# EAGLE schematic tetrisClock (EAGLE 5.10)
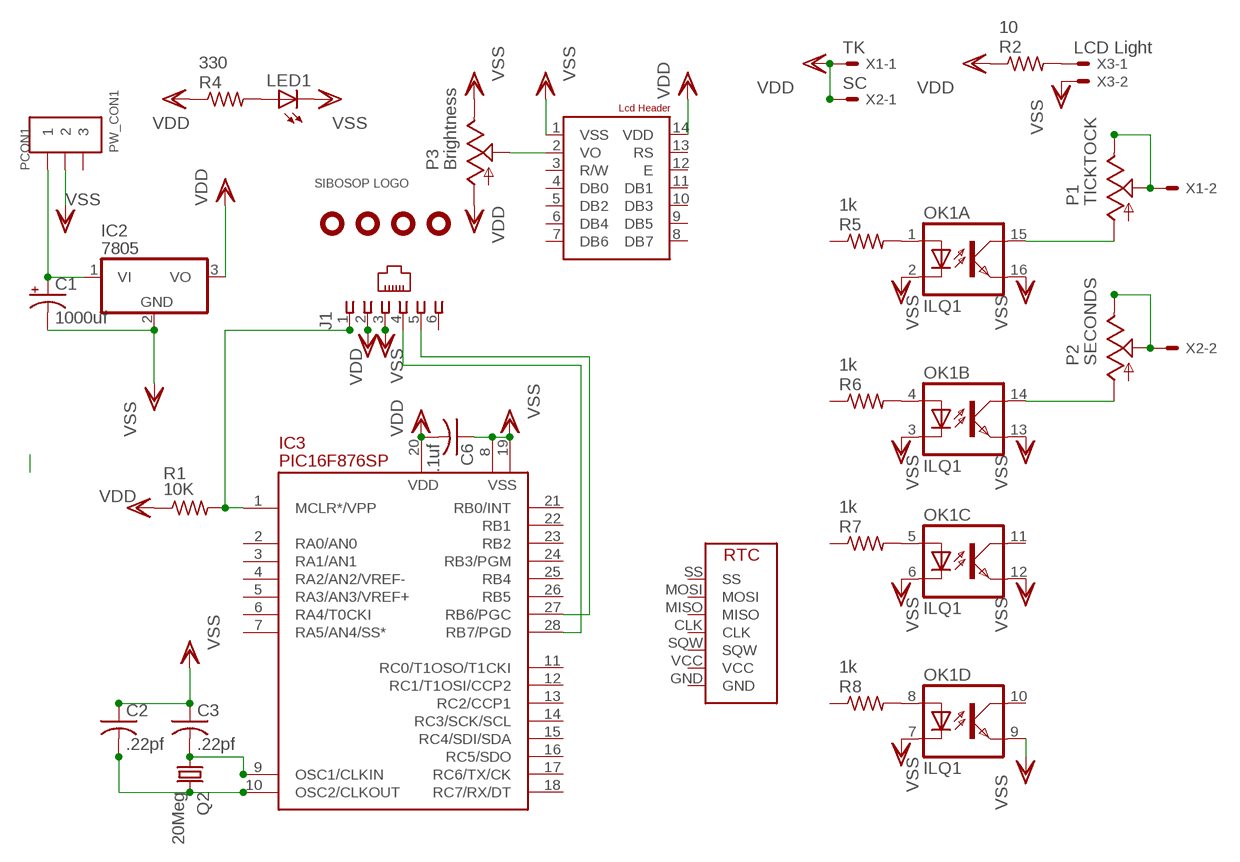
[diagram p0: schematic, sheet 1]

## Parts
C1  1000uf  CPOL-USE3.5-10  [E3,5-10]
C2  .22pf  C-US025-024X044  [C025-024X044]
C3  .22pf  C-US025-024X044  [C025-024X044]
C6  .1uf  C-US025-024X044  [C025-024X044]
H1  LCDHEADER  [DIL14]
IC2  7805  [TO220V]
IC3  PIC16F876SP  [DIL28-3]
J1  520250-3  [520250-3]
LED1  LEDSQR2X5  [LED2X5]
OK1  ILQ1  [DIL16]
P1  TICKTOCK  TRIMPOT  [RJ6S]
P2  SECONDS  TRIMPOT  [RJ6S]
P3  Brightness  TRIMPOT  [RJ6S]
PCON1  PW_CON1  [PW_CON1]
Q2  20Meg  CRYSTALHC49S  [HC49/S]
R1  10K  R-US_0204/2V  [0204V]
R2  10  R-US_0204/2V  [0204V]
R4  330  R-US_0204/2V  [0204V]
R5  1k  R-US_0204/2V  [0204V]
R6  1k  R-US_0204/2V  [0204V]
R7  1k  R-US_0204/2V  [0204V]
R8  1k  R-US_0204/2V  [0204V]
U1  SPARKRTC  [SPARKRTC]
U$1  HOLE-125  [HOLE-125]
U$2  HOLE-125  [HOLE-125]
U$3  LOGO  [LOGO]
U$5  HOLE-125  [HOLE-125]
U$6  HOLE-125  [HOLE-125]
X1  TK  22-23-2021  [22-23-2021]
X2  SC  22-23-2021  [22-23-2021]
X3  LCD Light  22-23-2021  [22-23-2021]

## Nets
N$1: IC3.1(MCLR*/VPP) J1.1 R1.2
N$2: C1.+ IC2.1(VI) PCON1.P$1
N$3: C2.2 IC3.10(OSC2/CLKOUT) Q2.2
N$4: C3.2 IC3.9(OSC1/CLKIN) Q2.1
N$5: P1.E P1.S X1.2
N$7: H1.2(VO) P3.S
N$8: P2.E P2.S X2.2
N$9: R2.2 X3.1
N$11: OK1.15(A:COL) P1.A
N$14: IC3.27(RB6/PGC) J1.5
N$15: OK1.14(B:COL) P2.A
N$18: IC3.28(RB7/PGD) J1.4
N$19: OK1.1(A:A) R5.2
N$20: OK1.4(B:A) R6.2
N$21: OK1.5(C:A) R7.2
N$22: LED1.A R4.2
N$23: OK1.8(D:A) R8.2
VDD: C6.2 H1.14(VDD) IC2.3(VO) IC3.20(VDD) J1.2 P3.A R1.1 R2.1 R4.1 X1.1 X2.1
VSS: C1.- C2.1 C3.1 C6.1 H1.1(VSS) IC2.2(GND) IC3.8(VSS) IC3.19(VSS) J1.3 LED1.K(C) OK1.2(A:C) OK1.3(B:C) OK1.6(C:C) OK1.7(D:C) OK1.9(D:EMIT) OK1.12(C:EMIT) OK1.13(B:EMIT) OK1.16(A:EMIT) P3.E PCON1.P$2 X3.2
Unconnected: H1.3(R/W) H1.4(DB0) H1.5(DB2) H1.6(DB4) H1.7(DB6) H1.8(DB7) H1.9(DB5) H1.10(DB3) H1.11(DB1) H1.12(E) H1.13(RS) IC3.2(RA0/AN0) IC3.3(RA1/AN1) IC3.4(RA2/AN2/VREF-) IC3.5(RA3/AN3/VREF+) IC3.6(RA4/T0CKI) IC3.7(RA5/AN4/SS*) IC3.11(RC0/T1OSO/T1CKI) IC3.12(RC1/T1OSI/CCP2) IC3.13(RC2/CCP1) IC3.14(RC3/SCK/SCL) IC3.15(RC4/SDI/SDA) IC3.16(RC5/SDO) IC3.17(RC6/TX/CK) IC3.18(RC7/RX/DT) IC3.21(RB0/INT) IC3.22(RB1) IC3.23(RB2) IC3.24(RB3/PGM) IC3.25(RB4) IC3.26(RB5) J1.6 OK1.10(D:COL) OK1.11(C:COL) PCON1.P$3 R5.1 R6.1 R7.1 R8.1 U1.CLK U1.MISO U1.MOSI U1.SQW U1.SS

## Power pins joined to a net without a drawn wire
GND: U1.GND
VCC: U1.VCC

## Library data of the parts
C1 = rcl:CPOL-US: POLARIZED CAPACITOR, American symbol
C2 C3 C6 = rcl:C-US: CAPACITOR, American symbol
H1 = sibosop:LCDHEADER: 14 pin lcd header
IC2 = kmarx1:78*: 78xx Family - Positive voltage regulator
IC3 = pic16f87x:PIC16F876: FLASH MICROCONTROLLER
J1 = con-amp:520250-3: AMP connector
LED1 = led:LED: LED OSRAM: - CHIPLED LG R971, LG N971, LY N971, LG Q971, LY Q971, LO R971, LY R971 LH N974, LH R974 LS Q976, LO Q976, LY Q976 LO Q996 - Hyper CHIPLED LW Q18S LB Q993, LB Q99A, LB R99A - SideLED LS A670, LO A670, LY A670, LG A670, LP A670 LB A673, LV A673, LT A673, LW A673 LH A674 LY A675 LS A676, LA A676, LO A676, LY A676, LW A676 LS A679, LY A679, LG A679 - Hyper Micro SIDELED® LS Y876, LA Y876, LO Y876, LY Y876 LT Y87S - SmartLED LW L88C, LW L88S LB L89C, LB L89S, LG L890 LS L89K, LO L89K, LY L89K LS L896, LA L896, LO L896, LY L896 - TOPLED LS T670, LO T670, LY T670, LG T670, LP T670 LSG T670, LSP T670, LSY T670, LOP T670, LYG T670 LG T671, LOG T671, LSG T671 LB T673, LV T673, LT T673, LW T673 LH T674 LS T676, LA T676, LO T676, LY T676, LB T676, LH T676, LSB T676, LW T676 LB T67C, LV T67C, LT T67C, LS T67K, LO T67K, LY T67K, LW E67C LS E67B, LA E67B, LO E67B, LY E67B, LB E67C, LV E67C, LT E67C LW T67C LS T679, LY T679, LG T679 LS T770, LO T770, LY T770, LG T770, LP T770 LB T773, LV T773, LT T773, LW T773 LH T774 LS E675, LA E675, LY E675, LS T675 LS T776, LA T776, LO T776, LY T776, LB T776 LHGB T686 LT T68C, LB T68C - Hyper Mini TOPLED® LB M676 - Mini TOPLED Santana® LG M470 LS M47K, LO M47K, LY M47K Source: http://www.osram.convergy.de LUXEON: - LUMILED® LXK2-PW12-R00, LXK2-PW12-S00, LXK2-PW14-U00, LXK2-PW14-V00 LXK2-PM12-R00, LXK2-PM12-S00, LXK2-PM14-U00 LXK2-PE12-Q00, LXK2-PE12-R00, LXK2-PE12-S00, LXK2-PE14-T00, LXK2-PE14-U00 LXK2-PB12-K00, LXK2-PB12-L00, LXK2-PB12-M00, LXK2-PB14-N00, LXK2-PB14-P00, LXK2-PB14-Q00 LXK2-PR12-L00, LXK2-PR12-M00, LXK2-PR14-Q00, LXK2-PR14-R00 LXK2-PD12-Q00, LXK2-PD12-R00, LXK2-PD12-S00 LXK2-PH12-R00, LXK2-PH12-S00 LXK2-PL12-P00, LXK2-PL12-Q00, LXK2-PL12-R00 Source: www.luxeon.com KINGBRIGHT: KA-3528ASYC Source: www.kingbright.com
OK1 = optocoupler:ILQ1: SIEMENS OPTO COUPLER
P1-P3 = sibosop:TRIMPOT
PCON1 = powerconnectorskt:PW_CON1
Q2 = crystal:CRYSTAL: CRYSTAL
R1 R2 R4-R8 = rcl:R-US_: RESISTOR, American symbol
U1 = sibosop:SPARKRTC: spark fun deadon rtc breakout board
U$1 U$2 U$5 U$6 = sibosop:HOLE-125
U$3 = sibosop:LOGO
X1-X3 = sibosop-con-molex:22-23-2021: .100" (2.54mm) Center Header - 2 Pin